# Altium schematic sheet jetson_nano_breakout_rev1.SchDoc: CAN Bus HAT
size B; Date: 12/22/2022; Author: Cole Tucker; Organization: ORGANIZATION; Address1: ADDRESS 1; Address2: ADDRESS 2; Address3: ADDRESS 3; Address4: ADDRESS 4; Revision: -; SheetNumber: 1; SheetTotal: 2; ENG_APP_DATE: --/--/--; DSN_APP_DATE: --/--/--; CHK_APP_DATE: --/--/--
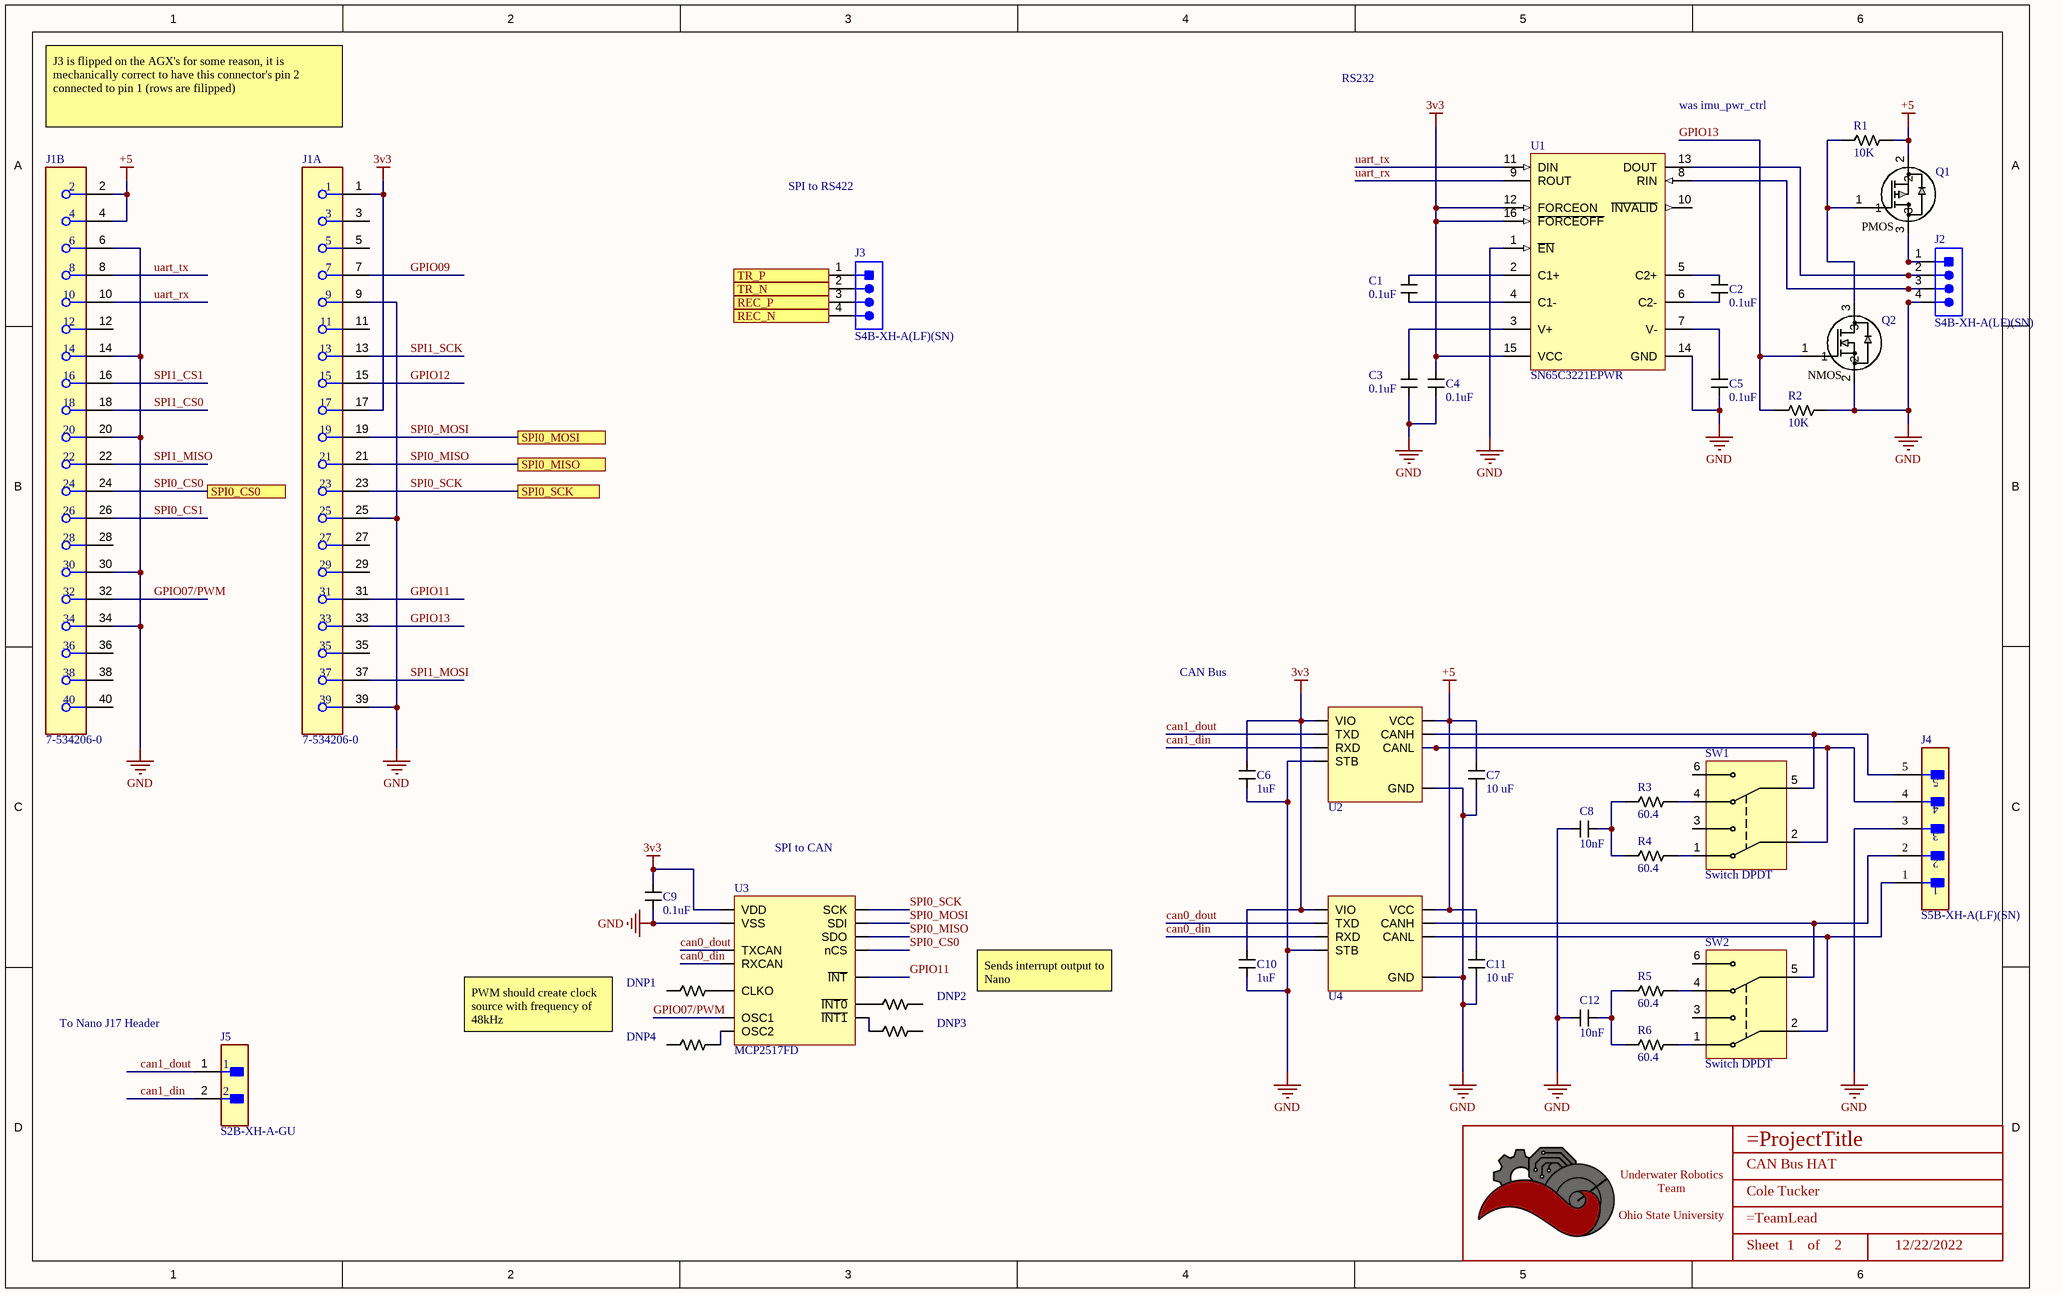
[diagram p0: jetson_nano_breakout_rev1.SchDoc]

## Parts
*  Title_Block  [LOGO]  (value not drawn)  (graphical)
C1  value 0.1uF  [CAPACITOR_0603]  (hidden comment: 100nF Ceramic 6.3V)
C2  value 0.1uF  [CAPACITOR_0603]  (hidden comment: 100nF Ceramic 6.3V)
C3  value 0.1uF  [CAPACITOR_0603]  (hidden comment: 100nF Ceramic 6.3V)
C4  value 0.1uF  [CAPACITOR_0603]  (hidden comment: 100nF Ceramic 6.3V)
C5  value 0.1uF  [CAPACITOR_0603]  (hidden comment: 100nF Ceramic 6.3V)
C6  value 1uF  [CAPACITOR_0603]  (hidden comment: 1uF Ceramic 16V)
C7  Value (uF): 10 uF  [CAPACITOR_0603]  (hidden comment: 10uF Ceramic 6.3V)
C8  value 10nF  [CAPACITOR_0603]  (hidden comment: 10nF Ceramic 6.3V)
C9  value 0.1uF  [CAPACITOR_0402]  (hidden comment: 100nF Ceramic 25V)
C10  value 1uF  [CAPACITOR_0603]  (hidden comment: 1uF Ceramic 16V)
C11  Value (uF): 10 uF  [CAPACITOR_0603]  (hidden comment: 10uF Ceramic 6.3V)
C12  value 10nF  [CAPACITOR_0603]  (hidden comment: 10nF Ceramic 6.3V)
DNP1  DNP  [RESISTOR_0402]  (value not drawn)
DNP2  DNP  [RESISTOR_0402]  (value not drawn)
DNP3  DNP  [RESISTOR_0402]  (value not drawn)
DNP4  DNP  [RESISTOR_0402]  (value not drawn)
J1  7-534206-0  [FP-7-534206-0-MFG]  (parts A,B of 2)
J2  S4B-XH-A(LF)(SN)  [JST-S4B-XH-A(LF)(SN)_V]
J3  S4B-XH-A(LF)(SN)  [JST-S4B-XH-A(LF)(SN)_V]
J4  S5B-XH-A(LF)(SN)  [FP-S5B-XH-A_LF_SN-MFG]
J5  S2B-XH-A-GU  [FP-S2B-XH-A-GU-MFG]
Q1  MOSFET P-CHANNEL 20V 4.7A SOT23  [SOT-23-3]  (value not drawn)
Q2  MOSFET N-CH 30V 5.8A SOT-23-3  [SOT-23-3]  (value not drawn)
R1  Value  (Ohms): 10K  [RESISTOR_0603]  (hidden comment: 10k Ohm 5% 1/10W)
R2  Value  (Ohms): 10K  [RESISTOR_0603]  (hidden comment: 10k Ohm 5% 1/10W)
R3  Value  (Ohms): 60.4  [RESISTOR_0402]  (hidden comment: 60.4 Ohm 1% 1/16W)
R4  Value  (Ohms): 60.4  [RESISTOR_0402]  (hidden comment: 60.4 Ohm 1% 1/16W)
R5  Value  (Ohms): 60.4  [RESISTOR_0402]  (hidden comment: 60.4 Ohm 1% 1/16W)
R6  Value  (Ohms): 60.4  [RESISTOR_0402]  (hidden comment: 60.4 Ohm 1% 1/16W)
SW1  Switch DPDT  [CAS-220TA]
SW2  Switch DPDT  [CAS-220TA]
U1  SN65C3221EPWR  [PW0016A_M]
U2  CAN Transceiver  [SOIC-8]  (value not drawn)
U3  MCP2517FD  [SOIC-14]
U4  CAN Transceiver  [SOIC-8]  (value not drawn)

## Ports
REC_N, REC_P, SPI0_CS0, SPI0_MISO, SPI0_MOSI, SPI0_SCK, TR_N, TR_P

## Nets
3v3: C4.1 C6.1 C9.1 C10.1 J1.1 J1.17 U1.12(FORCEON) U1.15(VCC) U1.16(~{FORCEOFF}) U2.5(VIO) U3.14(VDD) U4.5(VIO)
+5: C7.1 C11.1 J1.2 J1.4 Q1.2 R1.1 U2.3(VCC) U4.3(VCC)
GND: C3.2 C4.2 C5.2 C6.2 C7.2 C8.1 C9.2 C10.2 C11.2 C12.1 J1.6 J1.9 J1.14 J1.20 J1.25 J1.30 J1.34 J1.39 J2.4 J4.3 Q2.2 R2.2 U1.1(~{EN}) U1.14(GND) U2.2(GND) U2.8(STB) U3.7(VSS) U4.2(GND) U4.8(STB)
can0_din: U3.2(RXCAN) U4.4(RXD)
can0_dout: U3.1(TXCAN) U4.1(TXD)
can1_din: J5.2 U2.4(RXD)
can1_dout: J5.1 U2.1(TXD)
GPIO07/PWM: J1.32 U3.6(OSC1)
GPIO09: J1.7
GPIO11: J1.31 U3.4(~{INT})
GPIO12: J1.15
GPIO13: J1.33 Q2.1 R2.1
REC_N: J3.4 ; port REC_N
REC_P: J3.3 ; port REC_P
SPI0_CS0: J1.24 U3.13(nCS) ; port SPI0_CS0
SPI0_CS1: J1.26
SPI0_MISO: J1.21 U3.12(SDO) ; port SPI0_MISO
SPI0_MOSI: J1.19 U3.11(SDI) ; port SPI0_MOSI
SPI0_SCK: J1.23 U3.10(SCK) ; port SPI0_SCK
SPI1_CS0: J1.18
SPI1_CS1: J1.16
SPI1_MISO: J1.22
SPI1_MOSI: J1.37
SPI1_SCK: J1.13
TR_N: J3.2 ; port TR_N
TR_P: J3.1 ; port TR_P
uart_rx: J1.10 U1.9(ROUT)
uart_tx: J1.8 U1.11(DIN)
NetC1_1: C1.1 U1.2(C1+)
NetC1_2: C1.2 U1.4(C1-)
NetC2_1: C2.1 U1.5(C2+)
NetC2_2: C2.2 U1.6(C2-)
NetC3_1: C3.1 U1.3(V+)
NetC5_1: C5.1 U1.7(V-)
NetC8_2: C8.2 R3.2 R4.2
NetC12_2: C12.2 R5.2 R6.2
NetDNP1_1: DNP1.1 U3.3(CLKO)
NetDNP2_2: DNP2.2 U3.9(~{INT0})
NetDNP3_2: DNP3.2 U3.8(~{INT1})
NetDNP4_1: DNP4.1 U3.5(OSC2)
NetJ2_1: J2.1 Q1.3
NetJ2_2: J2.2 U1.13(DOUT)
NetJ2_3: J2.3 U1.8(RIN)
NetJ4_1: J4.1 SW2.2 U4.6(CANL)
NetJ4_2: J4.2 SW2.5 U4.7(CANH)
NetJ4_4: J4.4 SW1.2 U2.6(CANL)
NetJ4_5: J4.5 SW1.5 U2.7(CANH)
NetQ1_1: Q1.1 Q2.3 R1.2
NetR3_1: R3.1 SW1.4
NetR4_1: R4.1 SW1.1
NetR5_1: R5.1 SW2.4
NetR6_1: R6.1 SW2.1

Not connected (* = marked no-connect by the designer): DNP1 2; DNP2 1; DNP3 1; DNP4 2; J1 3 5 11 12 27 28 29 35 36 38 40; SW1 3 6; SW2 3 6; U1 10(~{INVALID})

## Notes on the sheet
- RS232
- J3 is flipped on the AGX's for some reason, it is mechanically correct to have this connector's pin 2 connected to pin 1 (rows are filipped)
- was imu_pwr_ctrl
- SPI to RS422
- CAN Bus
- SPI to CAN
- To Nano J17 Header
- PWM should create clock source with frequency of 48kHz
- Sends interrupt output to Nano
- DWG. NO.
- REV.
- SHT.
- THIS DOCUMENT AND THE DATA DISCLOSED HEREIN OR HEREWITH IS THE PROPERTY OF ALTIUM LIMITED AND MAY BE FREELY DISTRIBUTED IN WHOLE. NO RIGHTS ARE RESERVED OR EXPRESS OR IMPLIED WARANTEE GIVEN.
- REVISION
- DESCRIPTION
- DATE
- APPROVED
- ENG:
- APPROVALS
- PROJECT
- DSN:
- CHK:
- REFERENCE DOCUMENTS
- PROJECT REVISION:
- TITLE
- DOCUMENT REVISION:
- DESIGN ITEM:
- BOM:
- FAB DWG:
- PCB DWG:
- ASSY DWG:
- SCALE:
- SIZE
- B
- CAGE CODE
- FILE NAME
- DWG NO.
- SHEET
- OF
- REV
- (in symbol AO3404A) NMOS
- (in symbol Title_Block) Underwater Robotics Team / Ohio State University; Sheet; of
- (in symbol TSM500P02CX) PMOS

## Library data of the parts
* = Title_Block: UWRT Schematic Title Block Template / Created June 2021, Dylan Trainor
C1-C5 = CAPACITOR_0.1uF_0603: Cap 100nF 6.3V +/-10% / Ceramic 0603; Made By: Flip B; ComponentLink1Description: Datsheet; ComponentLink1URL: https://www.mouser.com/datasheet/2/212/KEM_C1002_X7R_SMD-1102033.pdf; Tolerance: +/- 10%; Voltage: 6.3V; Supplier 1: Digi-Key; Supplier Part Number 1: 399-15351-1-ND
C6 C10 = CAPACITOR_1uF_0603: Cap 1uF 16V +/-10% / Ceramic 0603; Made By: Flip B; Tolerance: +/- 10%; Voltage: 16V; Supplier 1: Digi-Key; Supplier Part Number 1: 399-7847-1-ND
C7 C11 = CAPACITOR_10uF_0603: Cap 10uF 6.3V +/-20% / Ceramic 0603; Made By: Flip B; ComponentLink1Description: Digikey; ComponentLink1URL: https://www.digikey.com/en/products/detail/samsung-electro-mechanics/CL10A106MQ8NNNC/3886777; Supplier 1: Digi-Key; Supplier Part Number 1: 1276-1119-1-ND; Tolerance: +/- 20%; Voltage: 6.3V
C8 C12 = CAPACITOR_0.01uF_0603: Cap 10nF 6.3V +/-20% / Ceramic 0603; Tolerance: +/- 10%; Made By: Flip B; ComponentLink1Description: Datsheet; ComponentLink1URL: https://www.mouser.com/datasheet/2/212/KEM_C1002_X7R_SMD-1102033.pdf; Voltage: 6.3V; Supplier 1: Mouser; Supplier Part Number 1: 80-C0603C103K9R
C9 = CAPACITOR_0.1uF_0402: Cap 100nF 25V +/-10% / Ceramic 0402; Made By: Robert Pafford; Tolerance: +/- 10%; Voltage: 25V; Supplier 1: Digi-Key; Supplier Part Number 1: 478-7868-1-ND
DNP1-DNP4 = DNP_0402: Do Not Populate 0402
J1 = CMP-03369-000068-1: CONN RCPT 40POS 0.1 GOLD PCB; Manufacturer: TE Connectivity; Standoff Height: 0.38mm; Voltage Rating: 333V; Conn Orientation: Vertical; Is Female: yes; Pitch: 2.54mm; Number Of Contacts: 40; Current Rating: 2A; Conn Gender: Female; Temperature: -65°C to +105°C; Temperature Range High: +105°C; Temperature Range Low: -65°C; Package: 7-534206-0; Lead Free: Yes; Manufacturer Part Number: 7-534206-0; Contact Material: Gold,Nickel; Device Class L2: Headers and Wire Housings; RoHS: TRUE; Number Of Rows: 2; Octopart: https://octopart.com/7-534206-0-te+connectivity-39516831; Device Class L3: unset; Device Class L1: Connectors; Mouser Description: Headers & Wire Housings REC 2X20P VRT T/H; ComponentLink2URL: https://octopart.com/datasheet/7-534206-0-te+connectivity-39516831; ComponentLink2Description: Datasheet; Digikey Description: CONN RCPT 40POS 0.1 GOLD PCB; Footprint Url: https://www.mouser.in/datasheet/2/418/NG_CD_534206_R7-1252933.pdf; Category: Conn; Height: 8.9mm; Automotive: No
J2 J3 = CMP-1755-00007-1: Male Header, Pitch 2.5 mm, 1 x 4 Position, Height 6.1 mm, Tail Length 3.4 mm, -25 to 85 degC, RoHS, Bulk; PackageReference: S4B-XH-A(LF)(SN); ComponentLink1Description: Manufacturer URL; DatasheetVersion: May-16; ComponentLink2Description: Datasheet; ComponentLink2URL: http://www.jst-mfg.com/product/pdf/eng/eXH.pdf; ComponentLink1URL: http://www.jst.com/home2.html; PackageDescription: Male Header, Pitch 2.5 mm, 1 x 4 Position, Height 6.1 mm, Tail Length 3.4 mm
J4 = CMP-17439-000302-1: CONN HEADER R/A 5POS 2.5MM; Contact Resistance: 10mR; Voltage Rating: 250V; Number of Contacts: 5; Current Rating: 3A; Insulation Resistance: 1GR; Wire/Cable Gauge: 22AWG; Number of Rows: 1; Contact Plating: Tin; Fastening Type: Detent; Contact Finish - Mating: TIN; Contact Material: Brass; Lead Free: Lead Free; Connector Type: Header; REACH SVHC: No SVHC; Insulation Color: Natural; Orientation: Right Angle; Contact Type: Male Pin; Pitch: 2.5mm; Contact Shape: Square; Series: XH; Color: Natural; Lead Pitch: 2.5mm; Mount: Through Hole; Termination: Solder; Max Operating Temperature: 85°C; Number of Positions: 5; Flammability Rating: UL94 V-0; Min Operating Temperature: -25°C; Packaging: Bulk; Voltage Rating (AC): 250V; Insulation Material: Nylon
J5 = CMP-17439-000226-1: Conn Shrouded Header HDR 2 POS 2.45mm Solder ST Top Entry Thru-Hole; Lead Free: Lead Free
Q1 = TSM500P02CX: P-Channel 20 V 4.7A (Tc) 1.56W (Tc) Surface Mount SOT-23; Vendor: Taiwan Semiconductor Corporation; Vgs (Max): ±10V; Vgs (th): 800mV @ 250µA; Rds (on): 50mOhm @ 3A, 4.5V; Amp Rating: 4.7 A; FET Type: P-Channel; Package: TO-236-3, SC-59, SOT-23-3; Manufacturer_Part_Number: TSM500P02CX; Vdss: 20 V; Power Dissipation: 1.56W (Tc); Created By: Robert Pafford; Supplier 1: Digi-Key; Supplier Part Number 1: TSM500P02CXRFGCT-ND
Q2 = AO3404A: N-Channel 30 V 5.8A (Ta) 1.4W (Ta) Surface Mount SOT-23-3; Vendor: Alpha & Omega Semiconductor Inc.; SourceLibrary: ON_Semiconductor_2020-01-13; Vgs (Max): 3V @ 5.8A, 10V; Vgs (th): 3V @ 250µA; Rds (on): 28mOhm @ 5.8A, 10V; Amp Rating: 5.8 A; FET Type: N-Channel; Package: SOT23-3L; Manufacturer _Part_Number: AO3404A; Vdss: 30V; Power Dissipation: 1.4W (Ta); Supplier 1: Digi-Key; Supplier Part Number 1: 785-1004-1-ND; Created By: Dylan T
R1 R2 = RESISTOR_10K_0603: RES 10k OHM 5% 1/10W 0603; Tolerance: +/- 5%; Wattage: 1/8W; Made By: Robert Pafford; ComponentLink1Description: Datasheet; ComponentLink1URL: https://www.bourns.com/docs/product-datasheets/CRxxxxx.pdf; Supplier: Digikey; Digikey Part Numer: CR0603-JW-104ELFTR-ND; Supplier 1: Digi-Key; Supplier Part Number 1: 2019-RK73B1JTTD103JCT-ND
R3-R6 = RESISTOR_60.4_0402: RES 60.4 OHM 1% 1/16W 0402; Tolerance: +/- 1%; Made By: Robert Pafford; Wattage: 1/16W; Supplier: Digikey; Digikey Part Numer: CR0603-JW-104ELFTR-ND; Supplier 1: Digi-Key; Supplier Part Number 1: 13-AC0402FR-0760R4LCT-ND
SW1 SW2 = CAS-220TA_CAN_TERM: GOLD SWITCH FLUSH SLIDE DPDT 100MA 6V; Made By: Robert Pafford; Voltage Rating: 6VDC; Current Rating: 100 mA; Switch Function: DPDT; Contact Finish: Gold; Supplier 1: Digi-Key; Supplier Part Number 1: CAS220JCT-ND
U1 = CMP-0299-01595-2: 3-V to 5.5-V Single-Channel RS-232 1-Mbit/s Line Driver / Receiver with ±15-kV IEC ESD Protection, -40 to 85 degC, 16-Pin SSOP (DB), Green (RoHS & no Sb/Br); ICC(Max)(mA): 1; ESD HBM(kV): +/-15; Single Supply: TRUE; Supply Voltage(s)(V): 3.3 or 5.0; PackageVersion: revG, Feb-2011; PackageReference: PW0016A; ComponentLink3Description: Package Specification; Drivers Per Package: 1; ComponentLink3URL: http://www.ti.com/litv/pdf/mpds361; Receivers Per Package: 1; IEC-61000-4-2 SUPPORT: TRUE; SubFamily: RS-232; ComponentLink1Description: Manufacturer URL; DatasheetVersion: SLLS694B; ComponentLink2Description: Datasheet; ComponentLink2URL: http://www.ti.com/general/docs/lit/getliterature.tsp?genericPartNumber=SN65C3221E&fileType=pdf; ComponentLink1URL: www.ti.com; RS-232: TRUE; PackageDescription: 16-Pin Plastic Thin Small Outline Package 5 x 4.4 mm Body ,0.65 mm Pitch
U2 U4 = TJA1442AT: CAN Interface IC High-Speed CAN Transceiver with Standby Mode; Made By: Robert Pafford; Max Data Rate: 5Mbps; Supplier 1: Mouser; Supplier Part Number 1: 771-TJA1442AT/0Z
U3 = MCP2517FD: CANbus Controller CAN 2.0 SPI Interface 14-SOIC; Made By: Robert Pafford; Max FD Rate: 8 Mbps